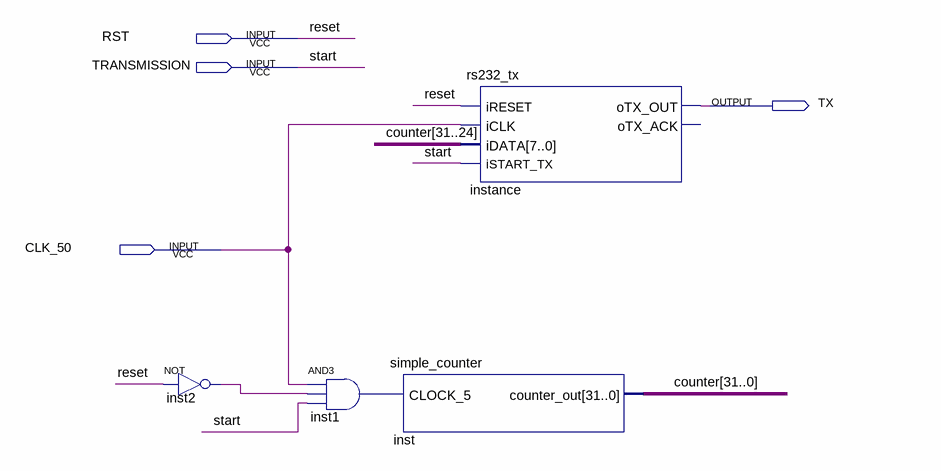
[diagram p0: schematic sheet]
// Quartus schematic rs232_transmitter.bdf as structural Verilog: 4 symbols, 4 pins
module rs232_transmitter (
  input  RST,
  input  TRANSMISSION,
  input  CLK_50,
  output TX
);

  wire inst1_out, inst2_out;
  wire [31:0] counter;

  not inst2 (inst2_out, RST);
  and inst1 (inst1_out, CLK_50, inst2_out, TRANSMISSION);
  simple_counter inst (.CLOCK_5(inst1_out), .counter_out(counter));
  rs232_tx \instance  (
    .iRESET(RST), .iCLK(CLK_50), .iDATA(counter[31:24]), .iSTART_TX(TRANSMISSION), .oTX_OUT(TX));  // open: oTX_ACK

  // Other names for the same wires on the sheet: reset = RST; start = TRANSMISSION
endmodule
